# Altium schematic sheet 0.73OLED.SchDoc
size A4
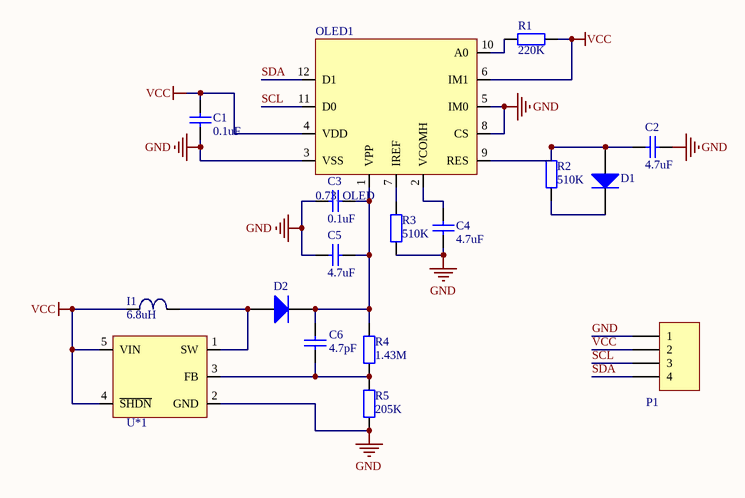
[diagram p0: 0.73OLED.SchDoc]

## Parts
C1  0.1uF  [1__0603-CAP_]
C2  4.7uF  [1__0603-CAP_]
C3  0.1uF  [1__0603-CAP_]
C4  4.7uF  [1__0603-CAP_]
C5  4.7uF  [1__0603-CAP_]
C6  4.7pF  [1__0603-CAP_]
D1  Diode  [二极管1206]  (value not drawn)
D2  Diode  [二极管1206]  (value not drawn)
I1  6.8uH  [0805_Ind]
OLED1  0.73_OLED  [0.73OLED]
P1  (no value)  [HDR1X4]
R1  220K  [1__0603-RES_]
R2  510K  [1__0603-RES_]
R3  510K  [1__0603-RES_]
R4  1.43M  [1__0603-RES_]
R5  205K  [1__0603-RES_]
U*1  OLED升压  [1__SOT23-5]  (value not drawn)

## Nets
GND: C1.2 C2.2 C3.2 C4.2 C5.2 OLED1.3(VSS) OLED1.5(IM0) OLED1.8(CS) P1.1 R3.2 R5.2 U*1.2(GND)
VCC: C1.1 I1.1 OLED1.4(VDD) OLED1.6(IM1) P1.2 R1.2 U*1.4(~{SHDN}) U*1.5(VIN)
SCL: OLED1.11(D0) P1.3
SDA: OLED1.12(D1) P1.4
NetC2_1: C2.1 D1.1(A) OLED1.9(RES) R2.1
NetC3_1: C3.1 C5.1 C6.2 D2.2(K) OLED1.1(VPP) R4.1
NetC4_1: C4.1 OLED1.2(VCOMH)
NetC6_1: C6.1 R4.2 R5.1 U*1.3(FB)
NetD1_2: D1.2(K) R2.2
NetD2_1: D2.1(A) I1.2 U*1.1(SW)
NetOLED1_7: OLED1.7(IREF) R3.1
NetOLED1_10: OLED1.10(A0) R1.1

## Library data of the parts
C1-C6 = Cap: Capacitor; Value: 104
D1 D2 = Diode: Default Diode; Published: 8-Jun-2000; LatestRevisionDate: 17-Jul-2002; LatestRevisionNote: Re-released for DXP Platform.; PackageVersion: Sep-1996; PackageReference: SMC; Publisher: Altium Limited; PackageDescription: DO-214-AB/SMC; 2 C-Bend Leads; Body 7.9 x 5.9 mm, inc. leads (LxW); Code_JEDEC: DO-214-AB
I1 = 电感: Value: 100uH
P1 = Header 4: Header, 4-Pin
R1-R5 = Res2: Resistor; Value: 10K
U*1 = TPS61040